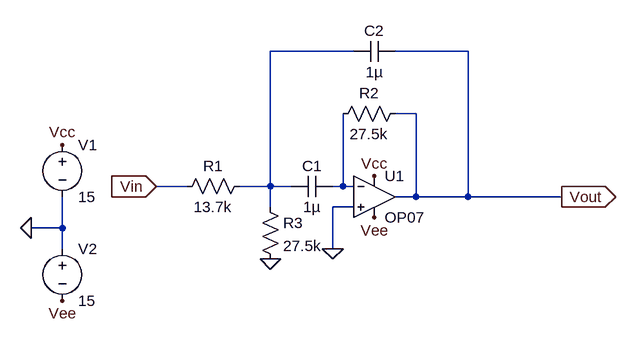
[diagram p0: schematic 10Hz.asc]
10Hz.asc, the LTspice schematic file:
Version 4
SHEET 1 880 680
WIRE 224 -48 96 -48
WIRE 400 -48 288 -48
WIRE 320 48 288 48
WIRE -32 160 -80 160
WIRE 96 160 96 -48
WIRE 96 160 48 160
WIRE 128 160 96 160
WIRE 208 160 208 48
WIRE 208 160 192 160
WIRE 224 160 208 160
WIRE 320 176 320 48
WIRE 320 176 288 176
WIRE 400 176 400 -48
WIRE 400 176 320 176
WIRE 544 176 400 176
WIRE 96 192 96 160
WIRE 224 192 192 192
WIRE -224 224 -224 176
WIRE -224 224 -272 224
WIRE -224 256 -224 224
WIRE 192 256 192 192
FLAG -272 224 0
FLAG -224 96 Vcc
FLAG -224 336 Vee
FLAG 96 272 0
FLAG 192 256 0
FLAG 256 144 Vcc
FLAG 256 208 Vee
FLAG 544 176 Vout
IOPIN 544 176 Out
FLAG -80 160 Vin
IOPIN -80 160 In
SYMBOL OpAmps\\OP07 256 112 R0
SYMATTR InstName U1
SYMBOL voltage -224 80 R0
WINDOW 123 0 0 Left 0
WINDOW 39 0 0 Left 0
SYMATTR InstName V1
SYMATTR Value 15
SYMBOL voltage -224 240 R0
WINDOW 123 0 0 Left 0
WINDOW 39 0 0 Left 0
SYMATTR InstName V2
SYMATTR Value 15
SYMBOL res 64 144 R90
WINDOW 0 0 56 VBottom 2
WINDOW 3 32 56 VTop 2
SYMATTR InstName R1
SYMATTR Value 13.7k
SYMBOL res 192 64 R270
WINDOW 0 32 56 VTop 2
WINDOW 3 0 56 VBottom 2
SYMATTR InstName R2
SYMATTR Value 27.5k
SYMBOL res 80 176 R0
SYMATTR InstName R3
SYMATTR Value 27.5k
SYMBOL cap 192 144 R90
WINDOW 0 0 32 VBottom 2
WINDOW 3 32 32 VTop 2
SYMATTR InstName C1
SYMATTR Value 1µ
SYMBOL cap 288 -64 R90
WINDOW 0 0 32 VBottom 2
WINDOW 3 32 32 VTop 2
SYMATTR InstName C2
SYMATTR Value 1µ

The netlist it stands for:
* 10Hz.asc
XU1 0 N002 Vcc Vee Vout LT1001  ; OP07, pins In+ In- V+ V- OUT
V1 Vcc 0 15
V2 0 Vee 15
R1 N001 Vin 13.7k
R2 N002 Vout 27.5k
R3 N001 0 27.5k
C1 N002 N001 1µ
C2 Vout N001 1µ
.lib LTC.lib
.backanno
.end